# Altium schematic sheet Mainboard_Power_Interface.SchDoc
size A4
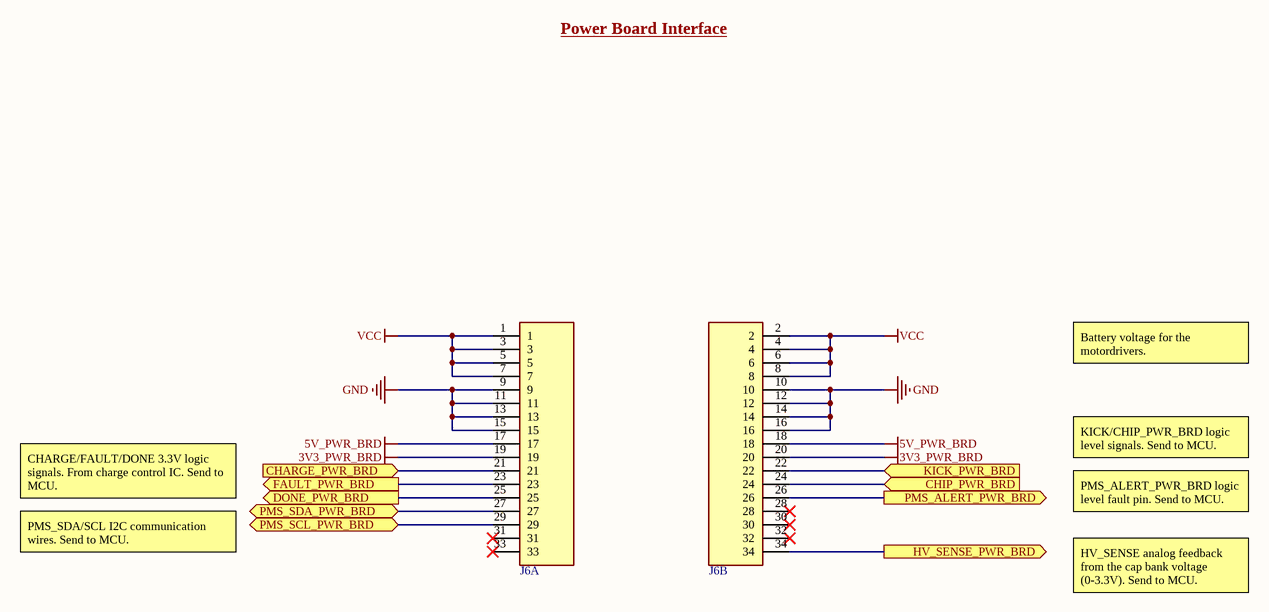
[diagram p0: Mainboard_Power_Interface.SchDoc]

## Parts
J6  0.1" Header Female 34  [SAMTEC-SSM-117-X-DV]  (value not drawn)  (parts A,B of 2)

## Ports
CHARGE_PWR_BRD (in), CHIP_PWR_BRD (in), DONE_PWR_BRD (out), FAULT_PWR_BRD (out), HV_SENSE_PWR_BRD (out), KICK_PWR_BRD (in), PMS_ALERT_PWR_BRD (out), PMS_SCL_PWR_BRD (bidir), PMS_SDA_PWR_BRD (bidir)

## Nets
3V3_PWR_BRD: J6.19 J6.20
5V_PWR_BRD: J6.17 J6.18
GND: J6.9 J6.10 J6.11 J6.12 J6.13 J6.14 J6.15 J6.16
VCC: J6.1 J6.2 J6.3 J6.4 J6.5 J6.6 J6.7 J6.8
CHARGE_PWR_BRD: J6.21 ; port CHARGE_PWR_BRD
CHIP_PWR_BRD: J6.24 ; port CHIP_PWR_BRD
DONE_PWR_BRD: J6.25 ; port DONE_PWR_BRD
FAULT_PWR_BRD: J6.23 ; port FAULT_PWR_BRD
HV_SENSE_PWR_BRD: J6.34 ; port HV_SENSE_PWR_BRD
KICK_PWR_BRD: J6.22 ; port KICK_PWR_BRD
PMS_ALERT_PWR_BRD: J6.26 ; port PMS_ALERT_PWR_BRD
PMS_SCL_PWR_BRD: J6.29 ; port PMS_SCL_PWR_BRD
PMS_SDA_PWR_BRD: J6.27 ; port PMS_SDA_PWR_BRD

Not connected (* = marked no-connect by the designer): J6 28* 30* 31* 32* 33*

## Notes on the sheet
- Power Board Interface
- Battery voltage for the motordrivers.
- KICK/CHIP_PWR_BRD logic level signals. Send to MCU.
- CHARGE/FAULT/DONE 3.3V logic signals. From charge control IC. Send to MCU.
- PMS_ALERT_PWR_BRD logic level fault pin. Send to MCU.
- PMS_SDA/SCL I2C communication wires. Send to MCU.
- HV_SENSE analog feedback from the cap bank voltage (0-3.3V). Send to MCU.

## Library data of the parts
J6 = CN HDR 34POS 2x17: Female Header THRU 34POS 2ROW 0.1" (2.54mm) pitch